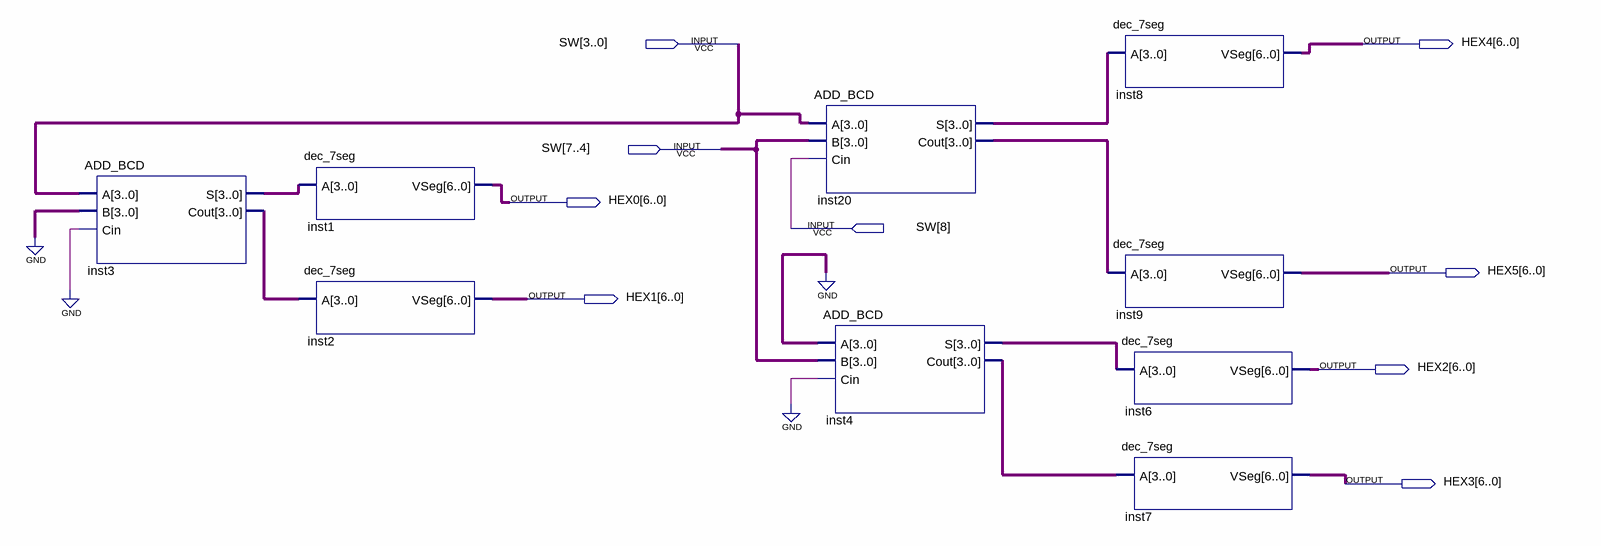
[diagram p0: schematic sheet]
// Quartus schematic TP3.bdf as structural Verilog: 9 symbols, 9 pins
module TP3 (
  input  [8:0] SW,
  output [6:0] HEX4,
  output [6:0] HEX0,
  output [6:0] HEX5,
  output [6:0] HEX1,
  output [6:0] HEX2,
  output [6:0] HEX3
);

  wire [3:0] inst3_cout, inst3_s, inst4_cout, inst4_s, inst20_cout, inst20_s;

  ADD_BCD inst3 (.A(SW[3:0]), .B(4'b0000), .Cin(1'b0), .S(inst3_s), .Cout(inst3_cout));
  dec_7seg inst1 (.A(inst3_s), .VSeg(HEX0));
  dec_7seg inst2 (.A(inst3_cout), .VSeg(HEX1));
  ADD_BCD inst20 (.A(SW[3:0]), .B(SW[7:4]), .Cin(SW[8]), .S(inst20_s), .Cout(inst20_cout));
  ADD_BCD inst4 (.A(4'b0000), .B(SW[7:4]), .Cin(1'b0), .S(inst4_s), .Cout(inst4_cout));
  dec_7seg inst8 (.A(inst20_s), .VSeg(HEX4));
  dec_7seg inst9 (.A(inst20_cout), .VSeg(HEX5));
  dec_7seg inst6 (.A(inst4_s), .VSeg(HEX2));
  dec_7seg inst7 (.A(inst4_cout), .VSeg(HEX3));
endmodule
